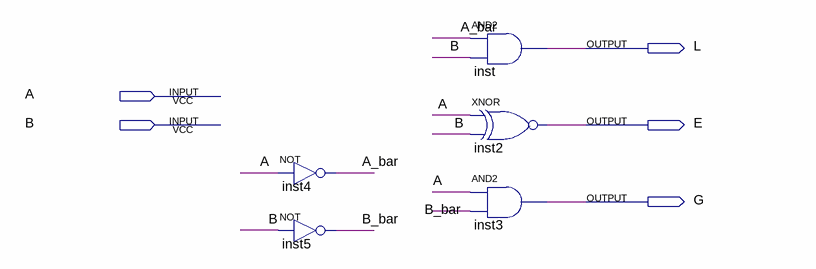
[diagram p0: schematic sheet]
// Quartus schematic one_bit_compare.bdf as structural Verilog: 5 symbols, 5 pins
module one_bit_compare (
  input  A,
  input  B,
  output L,
  output E,
  output G
);

  wire A_bar, B_bar;

  not inst4 (A_bar, A);
  not inst5 (B_bar, B);
  and inst (L, A_bar, B);
  xnor inst2 (E, A, B);
  and inst3 (G, A, B_bar);
endmodule
